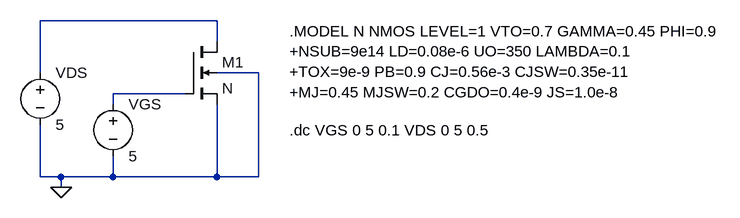
[diagram p0: schematic MOSFET-Transfer.asc]
MOSFET-Transfer.asc, the LTspice schematic file:
Version 4
SHEET 1 880 680
WIRE 0 0 -272 0
WIRE 0 32 0 0
WIRE -272 80 -272 0
WIRE 64 80 0 80
WIRE -48 112 -160 112
WIRE -160 128 -160 112
WIRE -272 240 -272 160
WIRE -240 240 -272 240
WIRE -160 240 -160 208
WIRE -160 240 -240 240
WIRE 0 240 0 128
WIRE 0 240 -160 240
WIRE 64 240 64 80
WIRE 64 240 0 240
WIRE -240 256 -240 240
FLAG -240 256 0
SYMBOL nmos4 -48 32 R0
SYMATTR InstName M1
SYMATTR Value N
SYMATTR Value2 l=4u w=1u
SYMBOL voltage -272 64 R0
WINDOW 123 0 0 Left 0
WINDOW 39 0 0 Left 0
SYMATTR InstName VDS
SYMATTR Value 5
SYMBOL voltage -160 112 R0
WINDOW 123 0 0 Left 0
WINDOW 39 0 0 Left 0
SYMATTR InstName VGS
SYMATTR Value 5
TEXT 112 16 Left 2 !.MODEL N NMOS LEVEL=1 VTO=0.7 GAMMA=0.45 PHI=0.9\n+NSUB=9e14 LD=0.08e-6 UO=350 LAMBDA=0.1\n+TOX=9e-9 PB=0.9 CJ=0.56e-3 CJSW=0.35e-11\n+MJ=0.45 MJSW=0.2 CGDO=0.4e-9 JS=1.0e-8
TEXT 112 168 Left 2 !.dc VGS 0 5 0.1 VDS 0 5 0.5

The netlist it stands for:
* MOSFET-Transfer.asc
M1 N001 N002 0 0 N l=4u w=1u
VDS N001 0 5
VGS N002 0 5
.model NMOS NMOS
.model PMOS PMOS
.lib standard.mos
.MODEL N NMOS LEVEL=1 VTO=0.7 GAMMA=0.45 PHI=0.9
+NSUB=9e14 LD=0.08e-6 UO=350 LAMBDA=0.1
+TOX=9e-9 PB=0.9 CJ=0.56e-3 CJSW=0.35e-11
+MJ=0.45 MJSW=0.2 CGDO=0.4e-9 JS=1.0e-8
.dc VGS 0 5 0.1 VDS 0 5 0.5
.backanno
.end